# Altium schematic sheet Camera.SchDoc: Camera.SchDoc
size A4; CheckedBy: fx; Author: flotox@yeah.net; Revision: v1.0.0; SheetNumber: 5; SheetTotal: 10
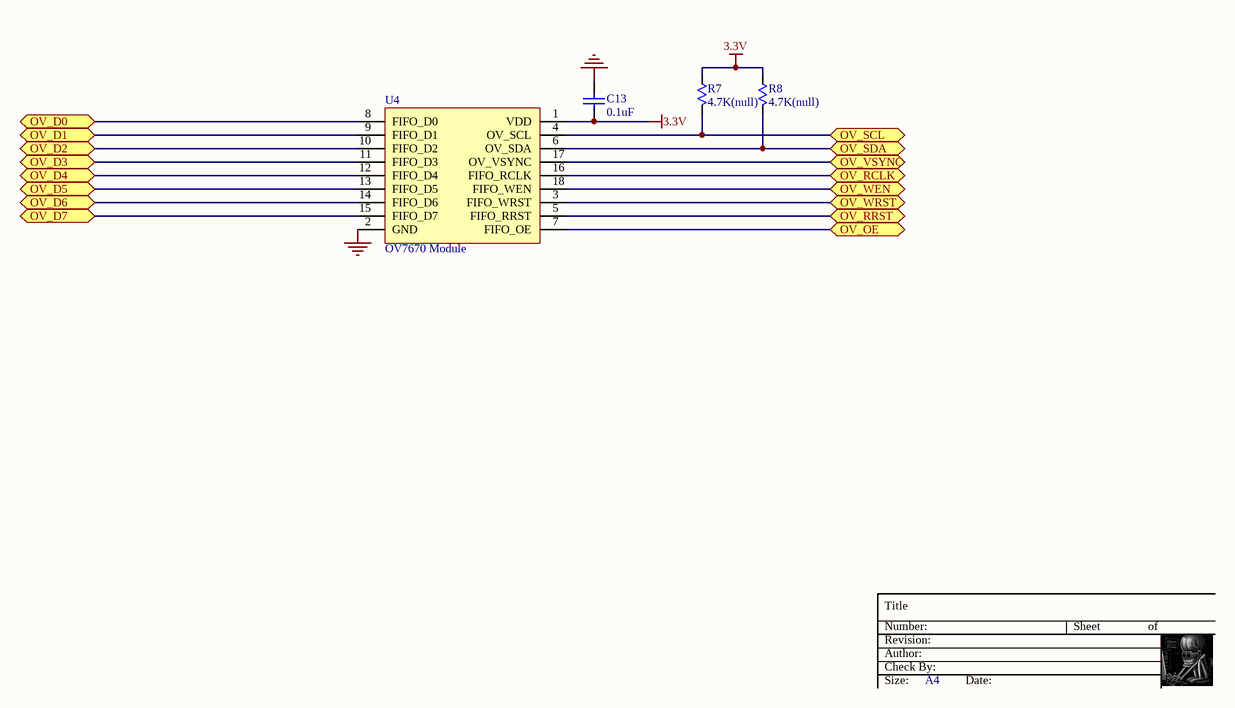
[diagram p0: Camera.SchDoc]

## Parts
C13  0.1uF  [C0603-S]
R7  4.7K(null)  [R0603-S]
R8  4.7K(null)  [R0603-S]
U4  OV7670 Module  [OV7670_MOD]

## Ports
OV_D0, OV_D1, OV_D2, OV_D3, OV_D4, OV_D5, OV_D6, OV_D7, OV_OE, OV_RCLK, OV_RRST, OV_SCL, OV_SDA, OV_VSYNC, OV_WEN, OV_WRST

## Nets
3.3V: C13.1 R7.2 R8.2 U4.1(VDD)
GND: C13.2 U4.2(GND)
OV_D0: U4.8(FIFO_D0) ; port OV_D0
OV_D1: U4.9(FIFO_D1) ; port OV_D1
OV_D2: U4.10(FIFO_D2) ; port OV_D2
OV_D3: U4.11(FIFO_D3) ; port OV_D3
OV_D4: U4.12(FIFO_D4) ; port OV_D4
OV_D5: U4.13(FIFO_D5) ; port OV_D5
OV_D6: U4.14(FIFO_D6) ; port OV_D6
OV_D7: U4.15(FIFO_D7) ; port OV_D7
OV_OE: U4.7(FIFO_OE) ; port OV_OE
OV_RCLK: U4.16(FIFO_RCLK) ; port OV_RCLK
OV_RRST: U4.5(FIFO_RRST) ; port OV_RRST
OV_SCL: R7.1 U4.4(OV_SCL) ; port OV_SCL
OV_SDA: R8.1 U4.6(OV_SDA) ; port OV_SDA
OV_VSYNC: U4.17(OV_VSYNC) ; port OV_VSYNC
OV_WEN: U4.18(FIFO_WEN) ; port OV_WEN
OV_WRST: U4.3(FIFO_WRST) ; port OV_WRST

## Notes on the sheet
- Title
- Revision:
- Number:
- Author:
- Check By:
- Sheet
- of
- Size:
- A4
- Date:

## Library data of the parts
C13 = CAP: Capacitor
R7 R8 = RES: Resistor
U4 = OV7670_MOD: ALIENTEK OV7670 Module